# EAGLE design ambihat (EAGLE 8.0.1)
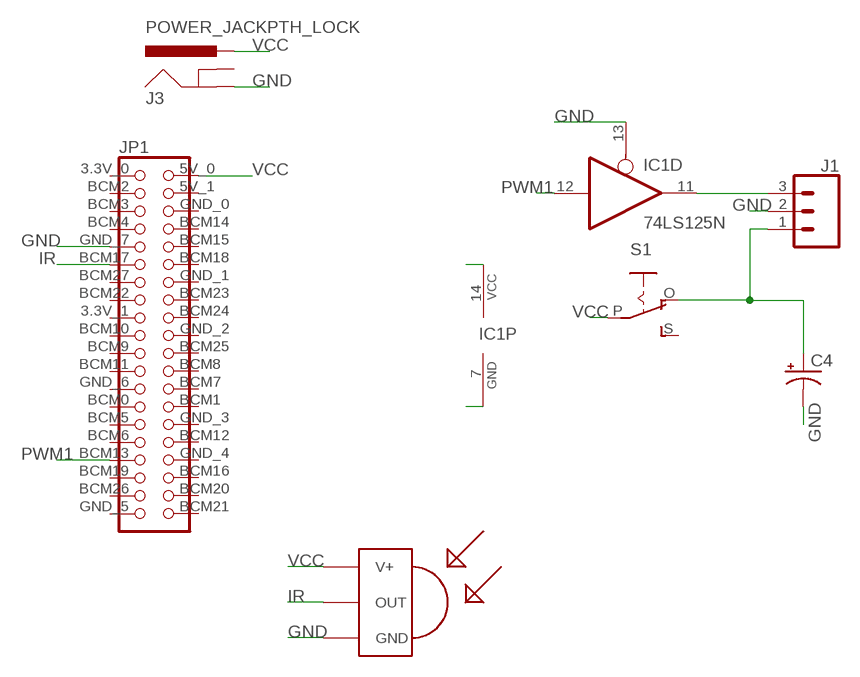
[diagram p0: schematic, sheet 1]

## Parts
C4  CPOL-USE5-10.5  [E5-10,5]
IC1  74LS125N  [DIL14]
J1  CONN_03JST-PTH-VERT  [JST-3-PTH-VERT]
J3  POWER_JACKPTH_LOCK  [POWER_JACK_PTH_LOCK]
JP1  RASPBERRY-HEADER  [RASPBERRY-HEADER]
S1  EG1218S  [EG1218]
U$1  TSOP4838  [TSOP18XX]

## Nets
GND: C4.- IC1.7(P:GND) IC1.13(D:OE) J1.2 J3.GND JP1.GND_7(9_GND) U$1.GND
IR: JP1.BCM17(11_BCM17) U$1.OUT
N$1: IC1.11(D:O) J1.3
N$2: C4.+ J1.1 S1.O
PWM1: IC1.12(D:I) JP1.BCM13(33_BCM13_PWM1)
VCC: IC1.14(P:VCC) J3.PWR JP1.5V_0(5V_1) S1.P U$1.VCC(V+)
Unconnected: IC1.1(A:OE) IC1.2(A:I) IC1.3(A:O) IC1.4(B:OE) IC1.5(B:I) IC1.6(B:O) IC1.8(C:O) IC1.9(C:I) IC1.10(C:OE) J3.GNDBREAK JP1.3.3V_0(1_3V3) JP1.3.3V_1(17_3V3) JP1.5V_1(4_5V5) JP1.BCM0(27_BCM0_ID_SD) JP1.BCM1(28_BCM1_ID_SC) JP1.BCM2(3_BCM2_SDA) JP1.BCM3(5_BCM3_SCL) JP1.BCM4(7_BCM4_GPCLK0) JP1.BCM5(29_BCM5) JP1.BCM6(31_BCM6) JP1.BCM7(26_BCM7_CE1) JP1.BCM8(24_BCM8_CE0) JP1.BCM9(21_BCM9_MISO) JP1.BCM10(19_BCM10_MOSI) JP1.BCM11(23_BCM11) JP1.BCM12(32_BCM12_PWM0) JP1.BCM14(8_BCM14_TXD) JP1.BCM15(10_BCM15_RXD) JP1.BCM16(36_BCM16) JP1.BCM18(12_BCM18_PWM0) JP1.BCM19(35_BCM19_MISO) JP1.BCM20(38_BCM20_MOSI) JP1.BCM21(40_BCM21_SCLK) JP1.BCM22(15_BCM22) JP1.BCM23(16_BCM23) JP1.BCM24(18_BCM24) JP1.BCM25(22_BCM25) JP1.BCM26(37_BCM26) JP1.BCM27(13_BCM27) JP1.GND_0(6_GND) JP1.GND_1(14_GND) JP1.GND_2(20_GND) JP1.GND_3(30_GND) JP1.GND_4(34_GND) JP1.GND_5(39_GND) JP1.GND_6(GND) S1.S

## Library data of the parts
C4 = adafruit:CPOL-US: POLARIZED CAPACITOR, American symbol
IC1 = adafruit:74*125: Quad bus BUFFER, 3-state
J1 = SparkFun-Connectors:CONN_03: Multi connection point. Often used as Generic Header-pin footprint for 0.1 inch spaced/style header connections On any of the 0.1 inch spaced packages, you can populate with these: Break Away Headers - Straight <https://www.sparkfun.com/products/116> (PRT-00116) Break Away Male Headers - Right Angle <https://www.sparkfun.com/products/553> (PRT-00553) Female Headers <https://www.sparkfun.com/products/115> (PRT-00115) Break Away Headers - Machine Pin <https://www.sparkfun.com/products/117> (PRT-00117) Break Away Female Headers - Swiss Machine Pin <https://www.sparkfun.com/products/743> (PRT-00743) Stackable Header - 3 Pin (Female, 0.1") <https://www.sparkfun.com/products/13875> (PRT-13875) For SCREWTERMINALS and SPRING TERMINALS visit here: Screw Terimnals on SparkFun.com <https://www.sparkfun.com/search/results?term=Screw+Terminals> (5mm/3.5mm/2.54mm spacing) This device is also useful as a general connection point to wire up your design to another part of your project. Our various solder wires solder well into these plated through hole pads. Hook-Up Wire - Assortment (Stranded, 22 AWG) <https://www.sparkfun.com/products/11375> (PRT-11375) Hook-Up Wire - Assortment (Solid Core, 22 AWG) <https://www.sparkfun.com/products/11367> (PRT-11367) View the entire wire category on our website here <https://www.sparkfun.com/categories/141> Special notes: Molex polarized connector foot print use with SKU : PRT-08232 with associated crimp pins and housings.; PROD_ID: CONN-13230
J3 = SparkFun-Connectors:POWER_JACK: Power Jack Connector This is the standard 5.5mm barrel jack for power. The PTH is the most common, proven, reliable, footprint. The Slot footprint only works if the mill layer is transmitted to the PCB fab house so be warned. Here are the connectors we sell at SparkFun: DC Barrel Power Jack/Connector <https://www.sparkfun.com/products/119> (PRT-00119) DC Barrel Power Jack/Connector (SMD) <https://www.sparkfun.com/products/12748> (PRT-12748) DC Barrel Jack Adapter - Breadboard Compatible <https://www.sparkfun.com/products/10811> (PRT-10811) It is used on this SparkFun product (and many, many others): SparkFun RedBoard - Programmed with Arduino <https://www.sparkfun.com/products/12757> (DEV-12757) Also, if you need a mating power supply or connector, please check these out: Wall Adapter Power Supply - 9VDC 650mA <https://www.sparkfun.com/products/298> (TOL-00298) DC Barrel Jack Adapter - Male <https://www.sparkfun.com/products/10287> (PRT-10287); PROD_ID: CONN-08197; SF_ID: PRT-00119
JP1 = raspberry-header:RASPBERRY-HEADER: PIN HEADER
S1 = adafruit:EG1218: SLIDING SWITCH 0.1" spacing through hole, vertical SPDT slide switch http://www.ladyada.net/library/pcb/eaglelibrary.html
U$1 = tsop:TSOP4838: IR Receiver and Demodulator

## Board
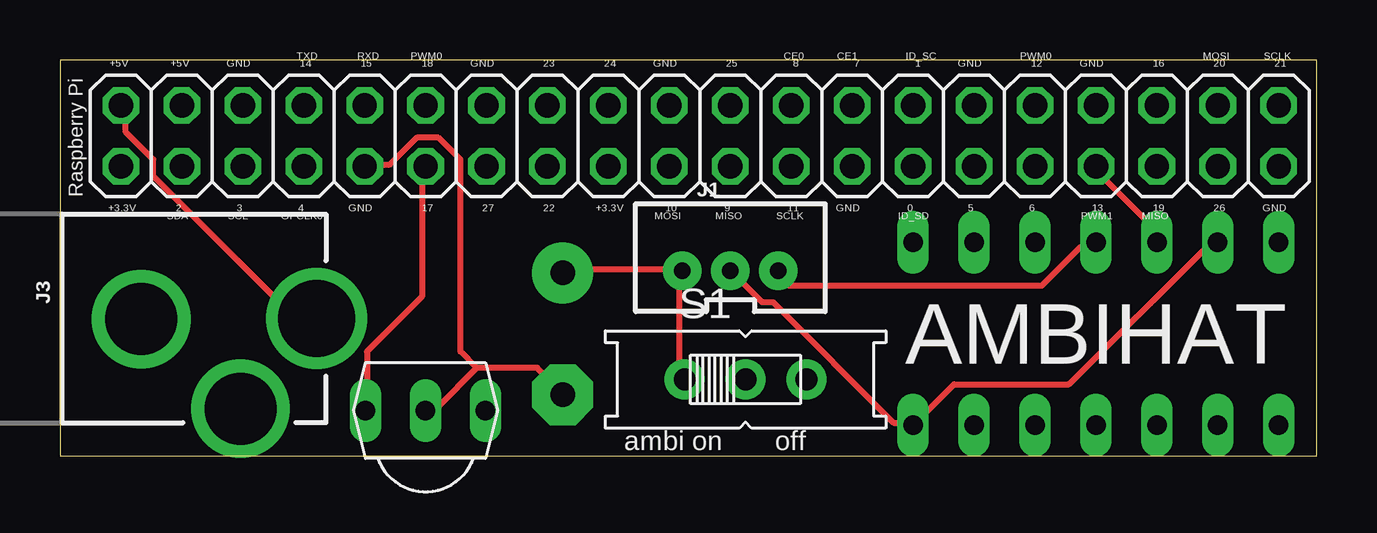
[diagram p1: board, top side]
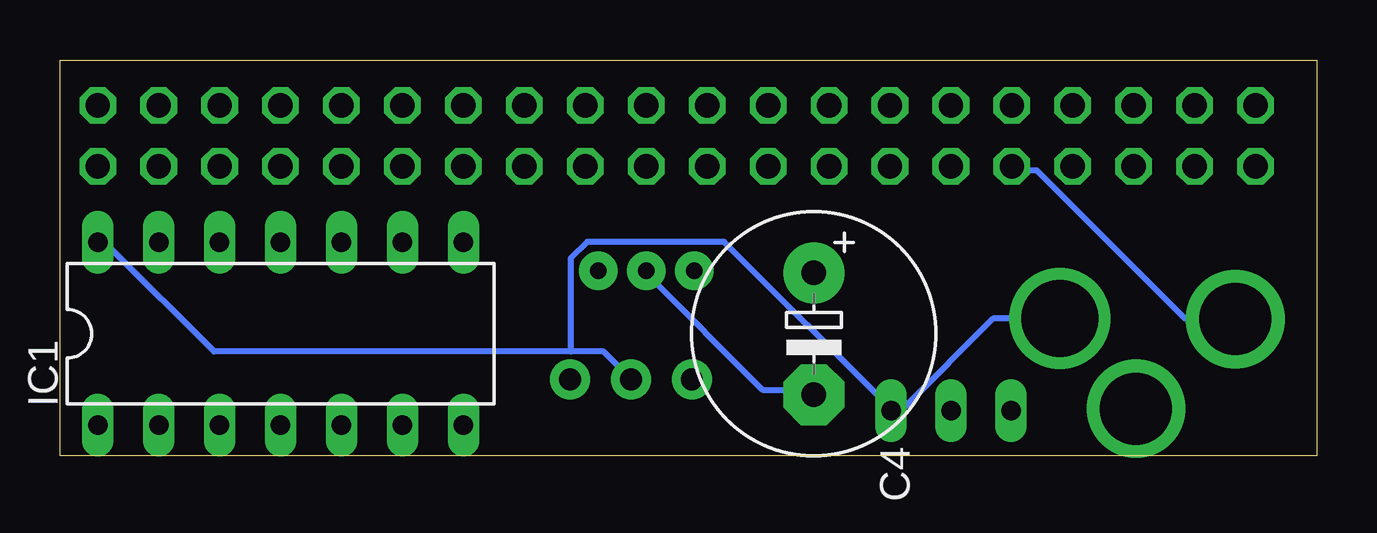
[diagram p2: board, bottom side, seen from below]

Size 52.38 x 16.5 mm. Coordinates in mm from the lower left corner, seen from the top.
Outline: 0,0 52.38,0 52.38,16.5 0,16.5 0,0
Copper layers (1*16): Top 0.035mm / dielectric 1.5mm / Bottom 0.035mm
Design rules "default": minimum track width 10mil, minimum drill 24mil, track to track 8mil, track to pad 8mil, pad to pad 8mil, via to via 8mil, smd to smd 8mil, copper to edge 40mil, drill to drill 8mil, minimum pad ring 10mil, minimum via ring 8mil, stop-mask expansion 4mil, vias tented up to drill 0mil, thermal gap 10mil

### Footprints (pad centres in the part's own frame; a part is rotated, then mirrored left to right if it is on the bottom)
E5-10,5 = drill 1.016 pad 2.54: + -2.54,0 | drill 1.016 pad 2.54 octagon: - 2.54,0
DIL14 = drill 0.813 long: 1 -7.62,-3.81; 2 -5.08,-3.81; 3 -2.54,-3.81; 4 0,-3.81; 5 2.54,-3.81; 6 5.08,-3.81; 7 7.62,-3.81; 8 7.62,3.81; 9 5.08,3.81; 10 2.54,3.81; 11 0,3.81; 12 -2.54,3.81; 13 -5.08,3.81; 14 -7.62,3.81
JST-3-PTH-VERT = drill 0.7 pad 1.6: 1 -2,-0.55; 2 0,-0.55; 3 2,-0.55
POWER_JACK_PTH_LOCK = drill 2.997 pad 4.115: GND 0.025,6.557; GNDBREAK 3.762,10.7 | drill 3.2 pad 4.115: PWR 0,13.878
RASPBERRY-HEADER = drill 1.016 octagon: 3.3V_0 -24.13,-1.27; 3.3V_1 -3.81,-1.27; 5V_0 -24.13,1.27; 5V_1 -21.59,1.27; BCM0 8.89,-1.27; BCM1 8.89,1.27; BCM2 -21.59,-1.27; BCM3 -19.05,-1.27; BCM4 -16.51,-1.27; BCM5 11.43,-1.27; BCM6 13.97,-1.27; BCM7 6.35,1.27; BCM8 3.81,1.27; BCM9 1.27,-1.27; BCM10 -1.27,-1.27; BCM11 3.81,-1.27; BCM12 13.97,1.27; BCM13 16.51,-1.27; BCM14 -16.51,1.27; BCM15 -13.97,1.27; BCM16 19.05,1.27; BCM17 -11.43,-1.27; BCM18 -11.43,1.27; BCM19 19.05,-1.27; BCM20 21.59,1.27; BCM21 24.13,1.27; BCM22 -6.35,-1.27; BCM23 -6.35,1.27; BCM24 -3.81,1.27; BCM25 1.27,1.27; BCM26 21.59,-1.27; BCM27 -8.89,-1.27; GND_0 -19.05,1.27; GND_1 -8.89,1.27; GND_2 -1.27,1.27; GND_3 11.43,1.27; GND_4 16.51,1.27; GND_5 24.13,-1.27; GND_6 6.35,-1.27; GND_7 -13.97,-1.27
EG1218 = drill 0.9 pad 1.676: O -2.54,0; P 0,0; S 2.54,0
TSOP18XX = drill 0.813 long: GND -0.001,-0.027; OUT -2.501,-0.027; VCC 2.499,-0.027

### Placement (x,y rotation side)
C4  20.95,5.08 270 bottom
IC1  43.18,5.08 0 bottom
J1  27.94,8.26 0 top
J3  -3.17,5.71 270 top
JP1  26.67,13.34 0 top
S1  28.57,3.17 0 top
U$1  15.24,1.91 0 top

### Tracks (layer width: path | path; a pad name or v marks a point on that pad's centre or on a via)
GND
  Top 0.254: 17.37,3.66 15.77,2.06 15.32,2.06 U$1.GND | 17.37,3.66 19.89,3.66 20.8,2.74 C4.- | J1.2 28.12,7.54 29.26,6.4 29.72,6.4 34.75,1.37 35.43,1.37 IC1.7 37.26,2.97 42.06,2.97 47.78,8.69 48.23,8.69 IC1.13 | 17.37,3.66 16.69,4.34 16.69,12.34 15.77,13.26 14.86,13.26 13.72,12.12 12.8,12.12 JP1.GND_7
  Bottom 0.254: JP1.GND_7 12.57,11.89 11.66,11.89 5.49,5.71 3.43,5.71 J3.GND | C4.- 21.03,2.74 23.09,2.74 27.89,7.54 J1.2
IR
  Top 0.254: U$1.OUT 12.8,2.06 12.8,4.34 15.09,6.63 15.09,11.89 JP1.BCM17
N$1
  Top 0.254: IC1.11 42.98,8.69 42.52,8.69 40.92,7.09 30.4,7.09 29.95,7.54 J1.3
N$2
  Top 0.254: S1.O 25.83,3.2 25.83,7.54 J1.1 25.83,7.77 21.03,7.77 C4.+
PWM1
  Top 0.254: IC1.12 45.72,9.37 43.2,11.89 JP1.BCM13
VCC
  Top 0.254: J3.PWR 9.83,5.71 3.89,11.66 3.89,12.34 2.74,13.49 2.74,14.4 JP1.5V_0
  Bottom 0.254: 31.09,4.34 29.72,4.34 28.57,3.2 S1.P | 31.09,4.34 45.95,4.34 50.29,8.69 50.75,8.69 IC1.14 | J3.PWR 13.49,5.71 17.14,2.06 17.6,2.06 U$1.VCC 17.83,2.06 24.69,8.91 30.4,8.91 31.09,8.23 31.09,4.34

### Text on the board
tNames: AMBIHAT | ambi on off